# Altium schematic sheet misc.SchDoc
size A4
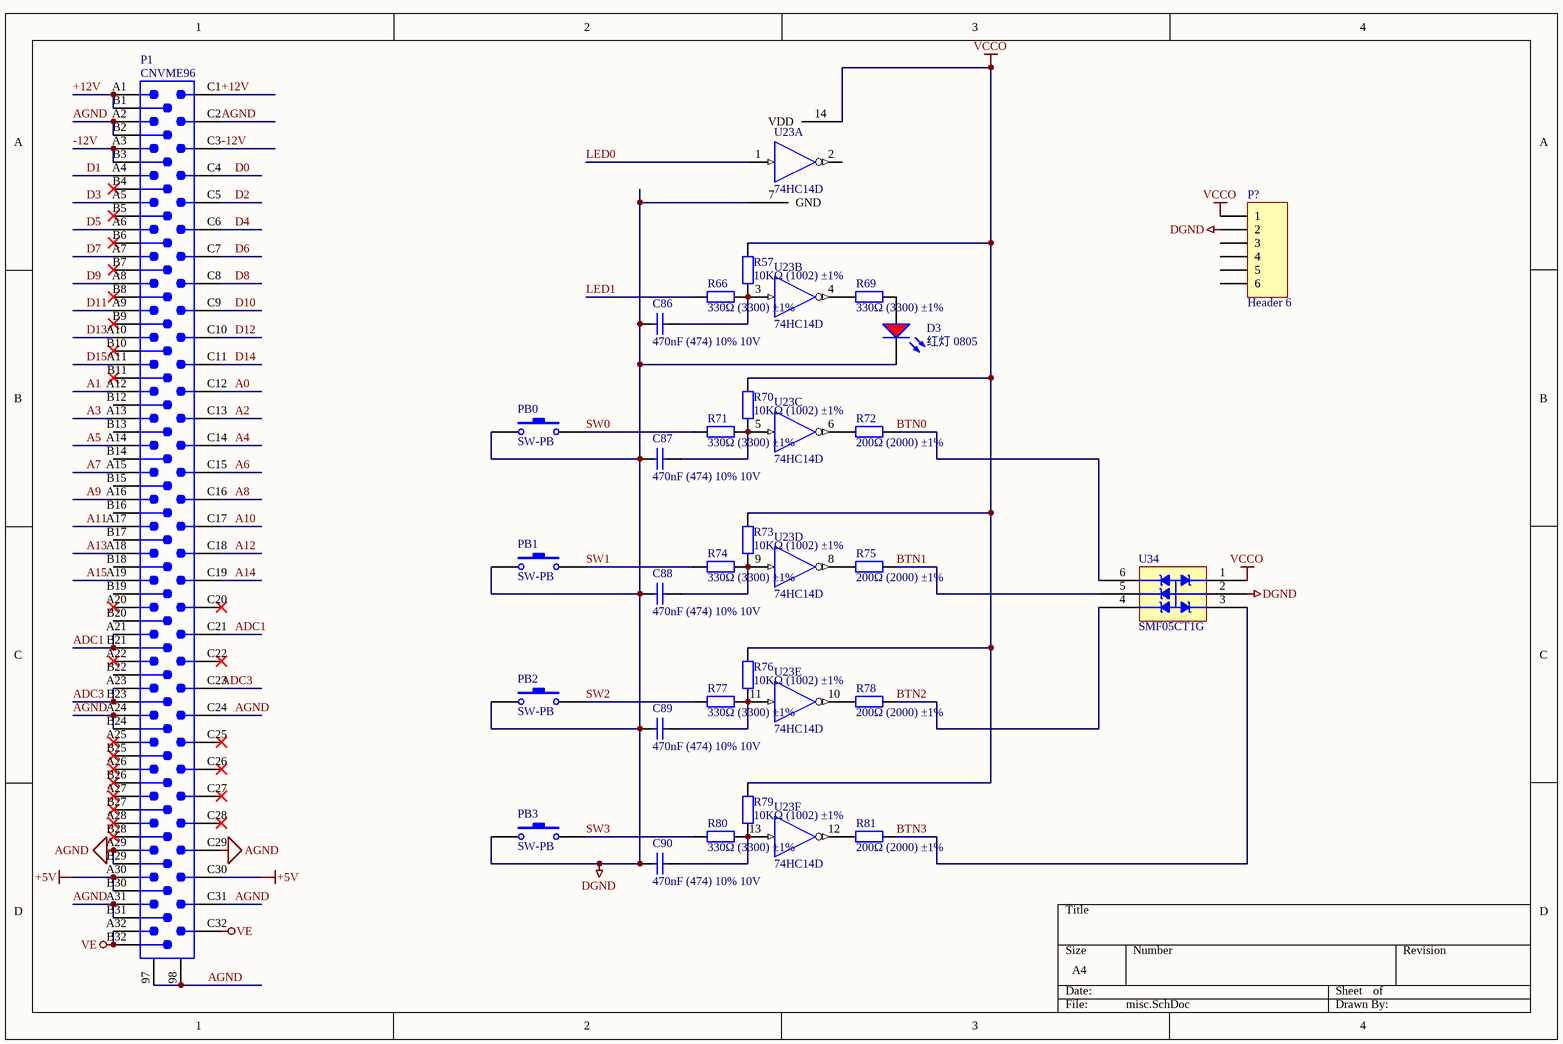
[diagram p0: misc.SchDoc]

## Parts
C86  470nF (474) 10% 10V  [0402_C]
C87  470nF (474) 10% 10V  [0402_C]
C88  470nF (474) 10% 10V  [0402_C]
C89  470nF (474) 10% 10V  [0402_C]
C90  470nF (474) 10% 10V  [0402_C]
D3  红灯 0805  [0805_LED_S1]
P1  CNVME96  [CNVME96]
P?  Header 6  [HDR1X6]
PB0  SW-PB  [SPST-2]
PB1  SW-PB  [SPST-2]
PB2  SW-PB  [SPST-2]
PB3  SW-PB  [SPST-2]
R57  10KΩ (1002) ±1%  [0402_R]
R66  330Ω (3300) ±1%  [0402_R]
R69  330Ω (3300) ±1%  [0402_R]
R70  10KΩ (1002) ±1%  [0402_R]
R71  330Ω (3300) ±1%  [0402_R]
R72  200Ω (2000) ±1%  [0402_R]
R73  10KΩ (1002) ±1%  [0402_R]
R74  330Ω (3300) ±1%  [0402_R]
R75  200Ω (2000) ±1%  [0402_R]
R76  10KΩ (1002) ±1%  [0402_R]
R77  330Ω (3300) ±1%  [0402_R]
R78  200Ω (2000) ±1%  [0402_R]
R79  10KΩ (1002) ±1%  [0402_R]
R80  330Ω (3300) ±1%  [0402_R]
R81  200Ω (2000) ±1%  [0402_R]
U23  74HC14D  [SOIC-14_150mil]  (parts A,B,C,D,E,F of 6)
U34  SMF05CT1G  [SC-70-6(SOT-363)]

## Nets
+5V: P1.A30 P1.B30 P1.C30
AGND: P1.97 P1.98 P1.A2 P1.A24 P1.A29 P1.A31 P1.B2 P1.B24 P1.B29 P1.B31 P1.C2 P1.C24 P1.C29 P1.C31
DGND: C86.1 C87.1 C88.1 C89.1 C90.1 D3.K P?.2 PB0.1 PB1.1 PB2.1 PB3.1 U23.7(GND) U34.2
VCCO: P?.1 R57.2 R70.2 R73.2 R76.2 R79.2 U23.14(VDD) U34.1
VE: P1.A32 P1.B32 P1.C32
+12V: P1.A1 P1.B1 P1.C1
-12V: P1.A3 P1.B3 P1.C3
A0: P1.C12
A1: P1.A12
A2: P1.C13
A3: P1.A13
A4: P1.C14
A5: P1.A14
A6: P1.C15
A7: P1.A15
A8: P1.C16
A9: P1.A16
A10: P1.C17
A11: P1.A17
A12: P1.C18
A13: P1.A18
A14: P1.C19
A15: P1.A19
ADC1: P1.A21 P1.B21 P1.C21
ADC3: P1.A23 P1.B23 P1.C23
BTN0: R72.2 U34.6
BTN1: R75.2 U34.5
BTN2: R78.2 U34.4
BTN3: R81.2 U34.3
D0: P1.C4
D1: P1.A4
D2: P1.C5
D3: P1.A5
D4: P1.C6
D5: P1.A6
D6: P1.C7
D7: P1.A7
D8: P1.C8
D9: P1.A8
D10: P1.C9
D11: P1.A9
D12: P1.C10
D13: P1.A10
D14: P1.C11
D15: P1.A11
LED0: U23.1(A)
LED1: R66.1
SW0: PB0.2 R71.1
SW1: PB1.2 R74.1
SW2: PB2.2 R77.1
SW3: PB3.2 R80.1
NetC86_2: C86.2 R57.1 R66.2 U23.3(A)
NetC87_2: C87.2 R70.1 R71.2 U23.5(A)
NetC88_2: C88.2 R73.1 R74.2 U23.9(A)
NetC89_2: C89.2 R76.1 R77.2 U23.11(A)
NetC90_2: C90.2 R79.1 R80.2 U23.13(A)
NetD3_A: D3.A R69.2
NetR69_1: R69.1 U23.4(Y)
NetR72_1: R72.1 U23.6(Y)
NetR75_1: R75.1 U23.8(Y)
NetR78_1: R78.1 U23.10(Y)
NetR81_1: R81.1 U23.12(Y)

Not connected (* = marked no-connect by the designer): P1 A20* A22* A25* A26* A27* A28* B4* B5* B6* B7* B8* B9* B10* B11* B12 B13 B14 B15 B16 B17 B18 B19 B20 B22 B25* B26* B27* B28* C20* C22* C25* C26* C27* C28*; P? 3 4 5 6; U23 2(Y)

## Library data of the parts
C86-C90 = 0402 470nF (474) 10% 10V: 贴片电容; ComponentLink1Description: 供应商链接; ComponentLink1URL: http://www.szlcsc.com/product/details_48344.html; Package: 0402; Supplier: LC; SuppliersPartNumber: C47339
D3 = 0805 红灯: 发光二极管; ComponentLink1Description: 供应商链接; ComponentLink1URL: http://www.szlcsc.com/product/details_2668.html; Package: 0805; Supplier: LC; SuppliersPartNumber: C2295
P1 = CNVME96: 96-Pin Connector (3x32 2.54mm grid); Text Field6: Alternate Layout Available; Text Field7: Published 14-Feb-2002
P? = Header 6: Header, 6-Pin; LatestRevisionDate: 17-Jul-2002; LatestRevisionNote: Re-released for DXP Platform.; Publisher: Altium Limited
PB0-PB3 = SW-PB: Switch; Published: 24-Mar-1999; LatestRevisionDate: 17-Jul-2002; LatestRevisionNote: Re-released for DXP Platform.; PackageReference: SPST-2; Publisher: Altium Limited; PackageDescription: Switch; 2 Leads
R57 R70 R73 R76 R79 = 0402 10KΩ (1002) 1%: 贴片电阻; ComponentLink1Description: 供应商链接; ComponentLink1URL: http://www.szlcsc.com/product/details_26487.html; Package: 0402; Supplier: LC; SuppliersPartNumber: C25744
R66 R69 R71 R74 R77 R80 = 0402 330Ω (3300) 1%: 贴片电阻; ComponentLink1Description: 供应商链接; ComponentLink1URL: http://www.szlcsc.com/product/details_25847.html; Package: 0402; Supplier: LC; SuppliersPartNumber: C25104
R72 R75 R78 R81 = 0402 200Ω (2000) 1%: 贴片电阻; ComponentLink1Description: 供应商链接; ComponentLink1URL: http://www.szlcsc.com/product/details_25830.html; Package: 0402; Supplier: LC; SuppliersPartNumber: C25087
U23 = 74HC14D_[C5605]: 74系列逻辑芯片; ComponentLink1Description: 供应商链接; ComponentLink1URL: http://www.szlcsc.com/product/details_6056.html; Package: SOIC-14_150mil; Supplier: LC; SuppliersPartNumber: C5605
U34 = SMF05CT1G_[C15879]: TVS; ComponentLink1Description: 供应商链接; ComponentLink1URL: http://www.szlcsc.com/product/details_16561.html; Package: SC-70-6(SOT-363); Supplier: LC; SuppliersPartNumber: C15879